# Altium schematic sheet Snip_SCMLI.SchDoc
size D
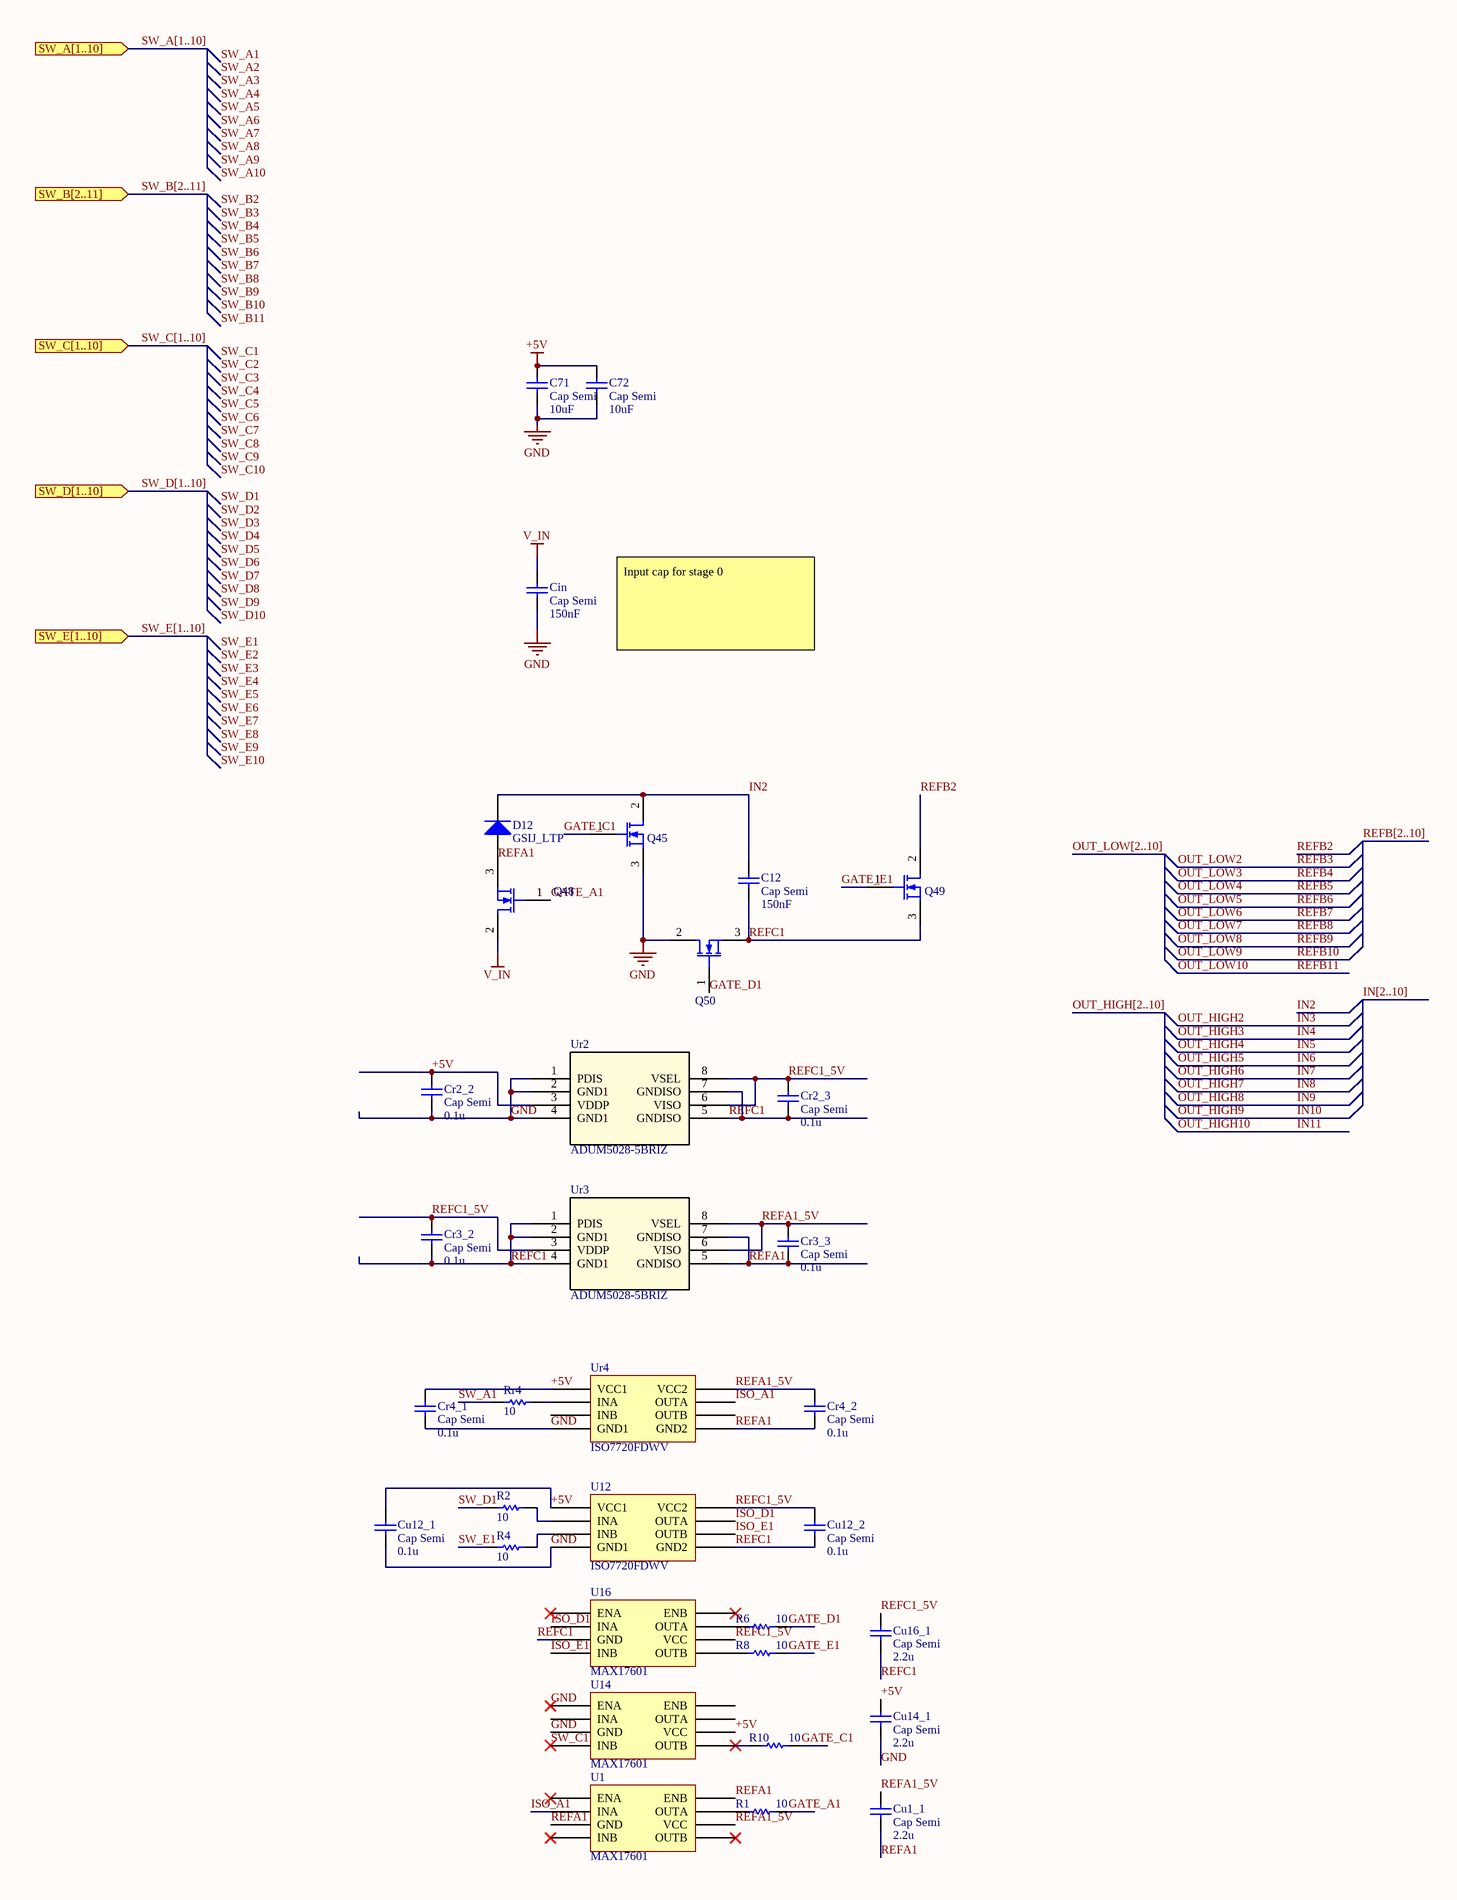
[diagram p0: Snip_SCMLI.SchDoc, left]
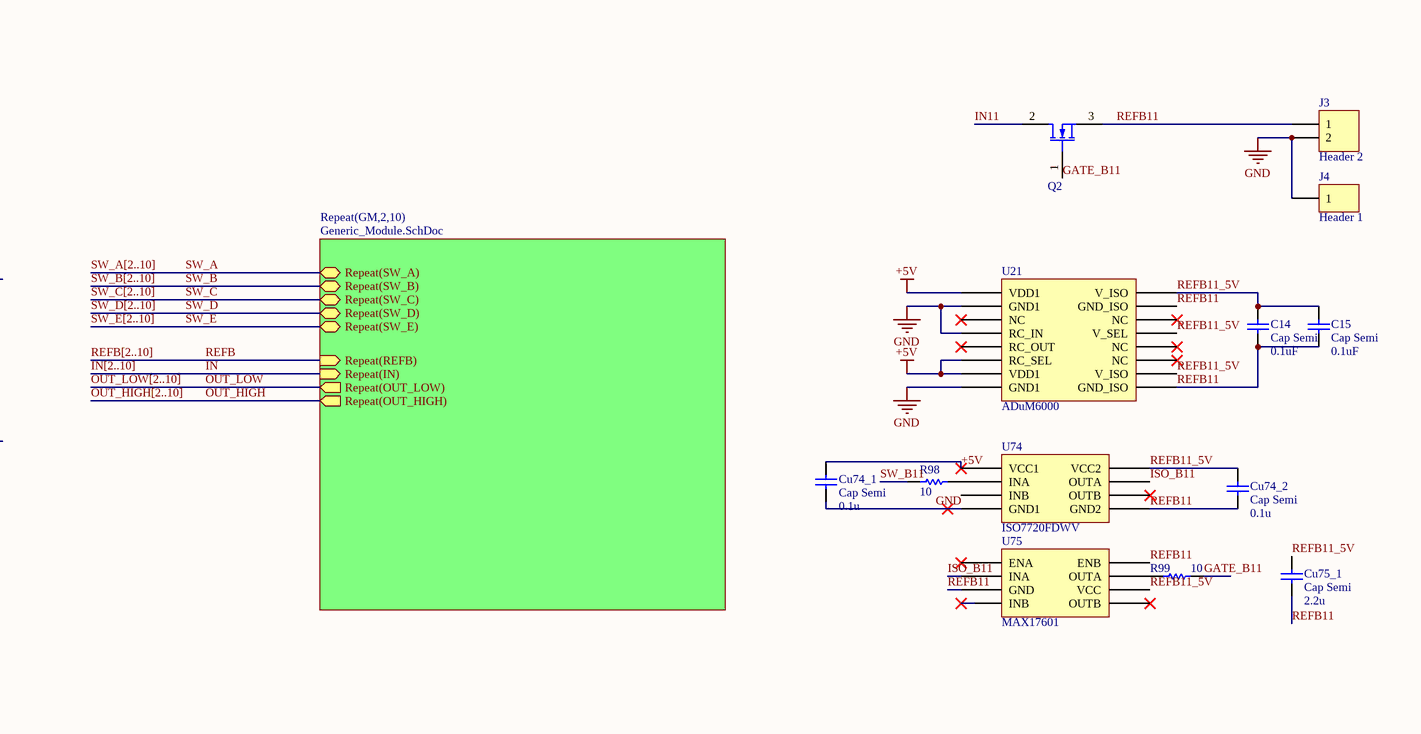
[diagram p1: Snip_SCMLI.SchDoc, right]

## Parts
C12  Cap Semi  value 150nF  [1812]
C14  Cap Semi  value 0.1uF  [J1-0603]
C15  Cap Semi  value 0.1uF  [J1-0603]
C71  Cap Semi  value 10uF  [1608[0603]]
C72  Cap Semi  value 10uF  [1608[0603]]
Cin  Cap Semi  value 150nF  [1812]
Cr2_2  Cap Semi  value 0.1u  [1608[0603]]
Cr2_3  Cap Semi  value 0.1u  [J1-0603]
Cr3_2  Cap Semi  value 0.1u  [1608[0603]]
Cr3_3  Cap Semi  value 0.1u  [1608[0603]]
Cr4_1  Cap Semi  value 0.1u  [C1206]
Cr4_2  Cap Semi  value 0.1u  [C1206]
Cu1_1  Cap Semi  value 2.2u  [1608[0603]]
Cu12_1  Cap Semi  value 0.1u  [C1206]
Cu12_2  Cap Semi  value 0.1u  [C1206]
Cu14_1  Cap Semi  value 2.2u  [1608[0603]]
Cu16_1  Cap Semi  value 2.2u  [1608[0603]]
Cu74_1  Cap Semi  value 0.1u  [C1206]
Cu74_2  Cap Semi  value 0.1u  [C1206]
Cu75_1  Cap Semi  value 2.2u  [1608[0603]]
D12  GSIJ_LTP  [SE30PAJ-M3]
J3  Header 2  [HVOUT]
J4  Header 1  [GNDOUT]
Q2  IPN80R1K2P7  [SOT233-3]  (value not drawn)
Q45  IPN80R1K2P7  [SOT233-3]  (value not drawn)
Q48  IPN80R1K2P7  [SOT233-3]  (value not drawn)
Q49  IPN80R1K2P7  [SOT233-3]  (value not drawn)
Q50  IPN80R1K2P7  [SOT233-3]  (value not drawn)
R1  10  [1608[0603]]
R2  10  [1608[0603]]
R4  10  [1608[0603]]
R6  10  [1608[0603]]
R8  10  [1608[0603]]
R10  10  [1608[0603]]
R98  10  [1608[0603]]
R99  10  [1608[0603]]
Rr4  10  [1608[0603]]
U1  MAX17601  [DFN-8_DD]
U12  ISO7720FDWV  [TI_DWV]
U14  MAX17601  [DFN-8_DD]
U16  MAX17601  [DFN-8_DD]
U21  ADuM6000  [SOIC127P1030X265-16N]
U74  ISO7720FDWV  [TI_DWV]
U75  MAX17601  [DFN-8_DD]
Ur2  ADUM5028-5BRIZ  [RI_8_1]
Ur3  ADUM5028-5BRIZ  [RI_8_1]
Ur4  ISO7720FDWV  [TI_DWV]

## Sub-sheets
Repeat(GM,2,10) = Generic_Module.SchDoc: Repeat(SW_A) (bidir), Repeat(SW_B) (bidir), Repeat(SW_C) (bidir), Repeat(SW_D) (bidir), Repeat(SW_E) (bidir), Repeat(REFB) (in), Repeat(IN) (in), Repeat(OUT_LOW) (out), Repeat(OUT_HIGH) (out)

## Ports
SW_A[1..10] (in), SW_B[2..11] (in), SW_C[1..10] (in), SW_D[1..10] (in), SW_E[1..10] (in)

## Nets
+5V: C71.2 C72.2 Cr2_2.2 Cr4_1.2 Cu12_1.2 Cu14_1.2 Cu74_1.2 U12.1(VCC1) U14.6(VCC) U21.1(VDD1) U21.6(RC_SEL) U21.7(VDD1) U74.1(VCC1) Ur2.3(VDDP) Ur4.1(VCC1)
GND: C71.1 C72.1 Cin.1 Cr2_2.1 Cr4_1.1 Cu12_1.1 Cu14_1.1 Cu74_1.1 J3.2 J4.1 Q45.3 Q50.2 U12.4(GND1) U14.1(ENA) U14.3(GND) U21.2(GND1) U21.4(RC_IN) U21.8(GND1) U74.4(GND1) Ur2.1(PDIS) Ur2.2(GND1) Ur2.4(GND1) Ur4.4(GND1)
V_IN: Cin.2 Q48.2
GATE_A1: Q48.1 R1.2
GATE_B11: Q2.1 R99.2
GATE_C1: Q45.1 R10.2
GATE_D1: Q50.1 R6.2
GATE_E1: Q49.1 R8.2
IN: sheet Repeat(GM,2,10)/Repeat(IN)
IN2: C12.2 D12.2(K) Q45.2
IN11: Q2.2  [also labelled OUT_HIGH10]
ISO_A1: U1.2(INA) Ur4.7(OUTA)
ISO_B11: U74.7(OUTA) U75.2(INA)
ISO_D1: U12.7(OUTA) U16.2(INA)
ISO_E1: U12.6(OUTB) U16.4(INB)
OUT_HIGH: sheet Repeat(GM,2,10)/Repeat(OUT_HIGH)
OUT_LOW: sheet Repeat(GM,2,10)/Repeat(OUT_LOW)
OUT_LOW10: C14.1 C15.1 Cu74_2.1 Cu75_1.1 J3.1 Q2.3 U21.9(GND_ISO) U21.15(GND_ISO) U74.5(GND2) U75.3(GND) U75.8(ENB)  [also labelled REFB11]
REFA1: Cr3_3.1 Cr4_2.1 Cu1_1.1 D12.1(A) Q48.3 U1.3(GND) U1.8(ENB) Ur3.5(GNDISO) Ur3.7(GNDISO) Ur4.5(GND2)
REFA1_5V: Cr3_3.2 Cr4_2.2 Cu1_1.2 U1.6(VCC) Ur3.6(VISO) Ur3.8(VSEL) Ur4.8(VCC2)
REFB: sheet Repeat(GM,2,10)/Repeat(REFB)
REFB2: Q49.2
REFB11_5V: C14.2 C15.2 Cu74_2.2 Cu75_1.2 U21.10(V_ISO) U21.13(V_SEL) U21.16(V_ISO) U74.8(VCC2) U75.6(VCC)
REFC1: C12.1 Cr2_3.1 Cr3_2.1 Cu12_2.1 Cu16_1.1 Q49.3 Q50.3 U12.5(GND2) U16.3(GND) Ur2.5(GNDISO) Ur2.7(GNDISO) Ur3.1(PDIS) Ur3.2(GND1) Ur3.4(GND1)
REFC1_5V: Cr2_3.2 Cr3_2.2 Cu12_2.2 Cu16_1.2 U12.8(VCC2) U16.6(VCC) Ur2.6(VISO) Ur2.8(VSEL) Ur3.3(VDDP)
SW_A: sheet Repeat(GM,2,10)/Repeat(SW_A)
SW_A1: Rr4.2
SW_B: sheet Repeat(GM,2,10)/Repeat(SW_B)
SW_B11: R98.2
SW_C: sheet Repeat(GM,2,10)/Repeat(SW_C)
SW_C1: U14.4(INB)
SW_D: sheet Repeat(GM,2,10)/Repeat(SW_D)
SW_D1: R2.2
SW_E: sheet Repeat(GM,2,10)/Repeat(SW_E)
SW_E1: R4.2
NetR1_1: R1.1 U1.7(OUTA)
NetR2_1: R2.1 U12.2(INA)
NetR4_1: R4.1 U12.3(INB)
NetR6_1: R6.1 U16.7(OUTA)
NetR8_1: R8.1 U16.5(OUTB)
NetR10_1: R10.1 U14.5(OUTB)
NetR98_1: R98.1 U74.2(INA)
NetR99_1: R99.1 U75.7(OUTA)
NetRr4_1: Rr4.1 Ur4.2(INA)

Not connected (* = marked no-connect by the designer): U1 1(ENA)* 4(INB)* 5(OUTB)*; U14 2(INA) 7(OUTA) 8(ENB); U16 1(ENA)* 8(ENB)*; U21 3(NC)* 5(RC_OUT)* 11(NC)* 12(NC)* 14(NC)*; U74 3(INB) 6(OUTB)*; U75 1(ENA)* 4(INB)* 5(OUTB)*; Ur4 3(INB) 6(OUTB)

## Buses and harness runs
bus IN[2..10]
bus OUT_HIGH[2..10]
bus OUT_LOW[2..10]
bus REFB[2..10]
bus SW_A[1..10] = port SW_A[1..10]
bus SW_A[2..10]
bus SW_B[2..10]
bus SW_B[2..11] = port SW_B[2..11]
bus SW_C[1..10] = port SW_C[1..10]
bus SW_C[2..10]
bus SW_D[1..10] = port SW_D[1..10]
bus SW_D[2..10]
bus SW_E[1..10] = port SW_E[1..10]
bus SW_E[2..10]

## Notes on the sheet
- Input cap for stage 0
- Labels drawn without touching a wire or pin: SW_A1, SW_A2, SW_A3, SW_A4, SW_A5, SW_A6, SW_A7, SW_A8, SW_A9, SW_A10, SW_B2, SW_B3, SW_B4, SW_B5, SW_B6, SW_B7, SW_B8, SW_B9, SW_B10, SW_B11, SW_C1, SW_C2, SW_C3, SW_C4, SW_C5, SW_C6, SW_C7, SW_C8, SW_C9, SW_C10, SW_D1, SW_D2, SW_D3, SW_D4, SW_D5, SW_D6, SW_D7, SW_D8, SW_D9, SW_D10, SW_E1, SW_E2, SW_E3, SW_E4, SW_E5, SW_E6, SW_E7, SW_E8, SW_E9, SW_E10
- Title
- Size:
- Date:
- File:
- D
- Number:
- Time:
- Revision:
- Sheet
- of

## Library data of the parts
C12 C14 C15 C71 C72 Cin Cr2_2 Cr2_3 Cr3_2 Cr3_3 Cr4_1 Cr4_2 Cu1_1 Cu12_1 Cu12_2 Cu14_1 Cu16_1 Cu74_1 Cu74_2 Cu75_1 = Cap Semi: Capacitor (Semiconductor SIM Model); Published: 8-Jun-2000; LatestRevisionDate: 29-May-2009; LatestRevisionNote: IPC-7351 Footprint Added.; PackageReference: C1206; Publisher: Altium Limited; PackageDescription: Chip Capacitor
D12 = SE30PAJ-M3
J3 = Header 2: Header, 2-Pin; LatestRevisionDate: 17-Jul-2002; LatestRevisionNote: Re-released for DXP Platform.; Publisher: Altium Limited
J4 = Header 1: Header, 1-Pin; LatestRevisionDate: 17-Jul-2002; LatestRevisionNote: Re-released for DXP Platform.; Publisher: Altium Limited
R1 R2 R4 R6 R8 R10 R98 R99 Rr4 = Resistor_ST: Resistor 0402 / 0603 / 0805; Value: 10K
U21 = ADuM6000: Isolatd 5V-5V DCDC power supply
Ur2 Ur3 = ADUM5028-5BRIZ: No Description Available; Copyright: Copyright (C) 2018 Accelerated Designs. All rights reserved; RefDes: RefDes; Type: DEV; Value: Value